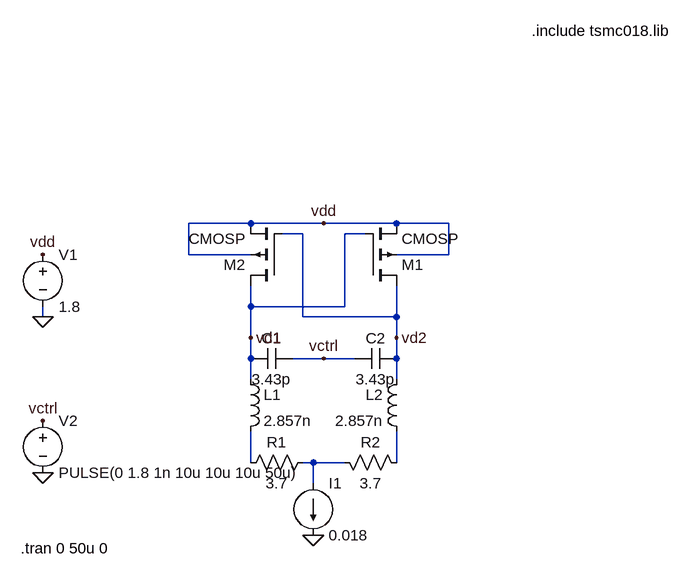
[diagram p0: schematic DiffVCO.asc]
DiffVCO.asc, the LTspice schematic file:
Version 4
SHEET 1 880 680
WIRE -192 0 -288 0
WIRE -80 0 -192 0
WIRE 32 0 -80 0
WIRE 112 0 32 0
WIRE -112 16 -144 16
WIRE -16 16 -48 16
WIRE -288 48 -288 0
WIRE -192 48 -288 48
WIRE 112 48 112 0
WIRE 112 48 32 48
WIRE -192 128 -192 96
WIRE -48 128 -48 16
WIRE -48 128 -192 128
WIRE -512 144 -512 128
WIRE -112 144 -112 16
WIRE 32 144 32 96
WIRE 32 144 -112 144
WIRE -192 176 -192 128
WIRE 32 176 32 144
WIRE -192 208 -192 176
WIRE -80 208 -128 208
WIRE -32 208 -80 208
WIRE 32 208 32 176
WIRE -192 240 -192 208
WIRE 32 240 32 208
WIRE -192 368 -192 320
WIRE -96 368 -112 368
WIRE -48 368 -96 368
WIRE 32 368 32 320
WIRE -96 400 -96 368
FLAG -96 480 0
FLAG -80 208 vctrl
FLAG -80 0 vdd
FLAG -192 176 vd1
FLAG 32 176 vd2
FLAG -512 144 0
FLAG -512 384 0
FLAG -512 48 vdd
FLAG -512 304 vctrl
SYMBOL cmosp -144 96 R180
SYMATTR InstName M2
SYMATTR SpiceModel ""
SYMATTR Value2 l=0.25u w=240u
SYMATTR SpiceLine ""
SYMATTR SpiceLine2 ""
SYMBOL cmosp -16 96 M180
SYMATTR InstName M1
SYMATTR SpiceModel ""
SYMATTR Value2 l=0.25u w=240u
SYMATTR SpiceLine ""
SYMATTR SpiceLine2 ""
SYMBOL cap -192 224 R270
WINDOW 0 32 32 VTop 2
WINDOW 3 0 32 VBottom 2
SYMATTR InstName C1
SYMATTR Value 3.43p
SYMATTR SpiceLine ""
SYMBOL cap 32 224 M270
WINDOW 0 32 32 VTop 2
WINDOW 3 0 32 VBottom 2
SYMATTR InstName C2
SYMATTR Value 3.43p
SYMATTR SpiceLine ""
SYMBOL ind -208 224 R0
SYMATTR InstName L1
SYMATTR Value 2.857n
SYMATTR SpiceLine ""
SYMBOL ind 48 224 M0
SYMATTR InstName L2
SYMATTR Value 2.857n
SYMATTR SpiceLine ""
SYMBOL res -208 384 R270
WINDOW 0 32 56 VTop 2
WINDOW 3 0 56 VBottom 2
SYMATTR InstName R1
SYMATTR Value 3.7
SYMATTR SpiceLine ""
SYMBOL res 48 384 M270
WINDOW 0 32 56 VTop 2
WINDOW 3 0 56 VBottom 2
SYMATTR InstName R2
SYMATTR Value 3.7
SYMATTR SpiceLine ""
SYMBOL current -96 400 R0
WINDOW 123 0 0 Left 2
WINDOW 39 0 0 Left 2
SYMATTR InstName I1
SYMATTR Value 0.018
SYMATTR Value2 ""
SYMATTR SpiceLine ""
SYMBOL voltage -512 32 R0
WINDOW 123 0 0 Left 2
WINDOW 39 0 0 Left 2
SYMATTR InstName V1
SYMATTR Value 1.8
SYMATTR Value2 ""
SYMATTR SpiceLine ""
SYMBOL voltage -512 288 R0
WINDOW 123 0 0 Left 2
WINDOW 39 0 0 Left 2
SYMATTR InstName V2
SYMATTR Value PULSE(0 1.8 1n 10u 10u 10u 50u)
SYMATTR Value2 ""
SYMATTR SpiceLine ""
TEXT 240 -296 Left 2 !.include tsmc018.lib
TEXT -546 500 Left 2 !.tran 0 50u 0

The netlist it stands for:
* DiffVCO.asc
M2 vd1 vd2 vdd vdd CMOSP l=0.25u w=240u
M1 vd2 vd1 vdd vdd CMOSP l=0.25u w=240u
C1 vd1 vctrl 3.43p
C2 vd2 vctrl 3.43p
L1 vd1 N001 2.857n
L2 vd2 N003 2.857n
R1 N001 N002 3.7
R2 N003 N002 3.7
I1 N002 0 0.018
V1 vdd 0 1.8
V2 vctrl 0 PULSE(0 1.8 1n 10u 10u 10u 50u)
.model NMOS NMOS
.model PMOS PMOS
.lib standard.mos
.include tsmc018.lib
.tran 0 50u 0
.backanno
.end